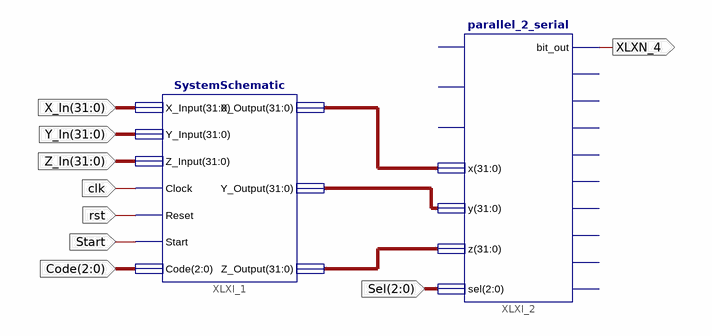
[diagram p0: schematic sheet 1]
// Xilinx ISE schematic CORDIC_UART.sch (spartan3e) as structural Verilog: 2 symbols, 9 ports
module CORDIC_UART (
  input  [31:0] X_In,
  input  [31:0] Y_In,
  input  [31:0] Z_In,
  input  clk,
  input  rst,
  input  Start,
  input  [2:0] Code,
  input  [2:0] Sel,
  output XLXN_4
);

  wire [31:0] XLXN_1, XLXN_2, XLXN_3;

  SystemSchematic XLXI_1 (
    .X_Input(X_In), .Y_Input(Y_In), .Z_Input(Z_In), .Clock(clk), .Reset(rst), .Start(Start), .Code(Code),
    .X_Output(XLXN_1), .Y_Output(XLXN_2), .Z_Output(XLXN_3));
  parallel_2_serial XLXI_2 (
    .x(XLXN_1), .y(XLXN_2), .z(XLXN_3), .sel(Sel), .bit_out(XLXN_4));  // open: done, clk, reset, slow_clk_out, ns_send_data, ps_send_data, ns_ascii, ps_ascii, ns_uart, ps_uart, uart_ready, ascii_ready
endmodule
